# Altium schematic sheet Sheet1.SchDoc
size C
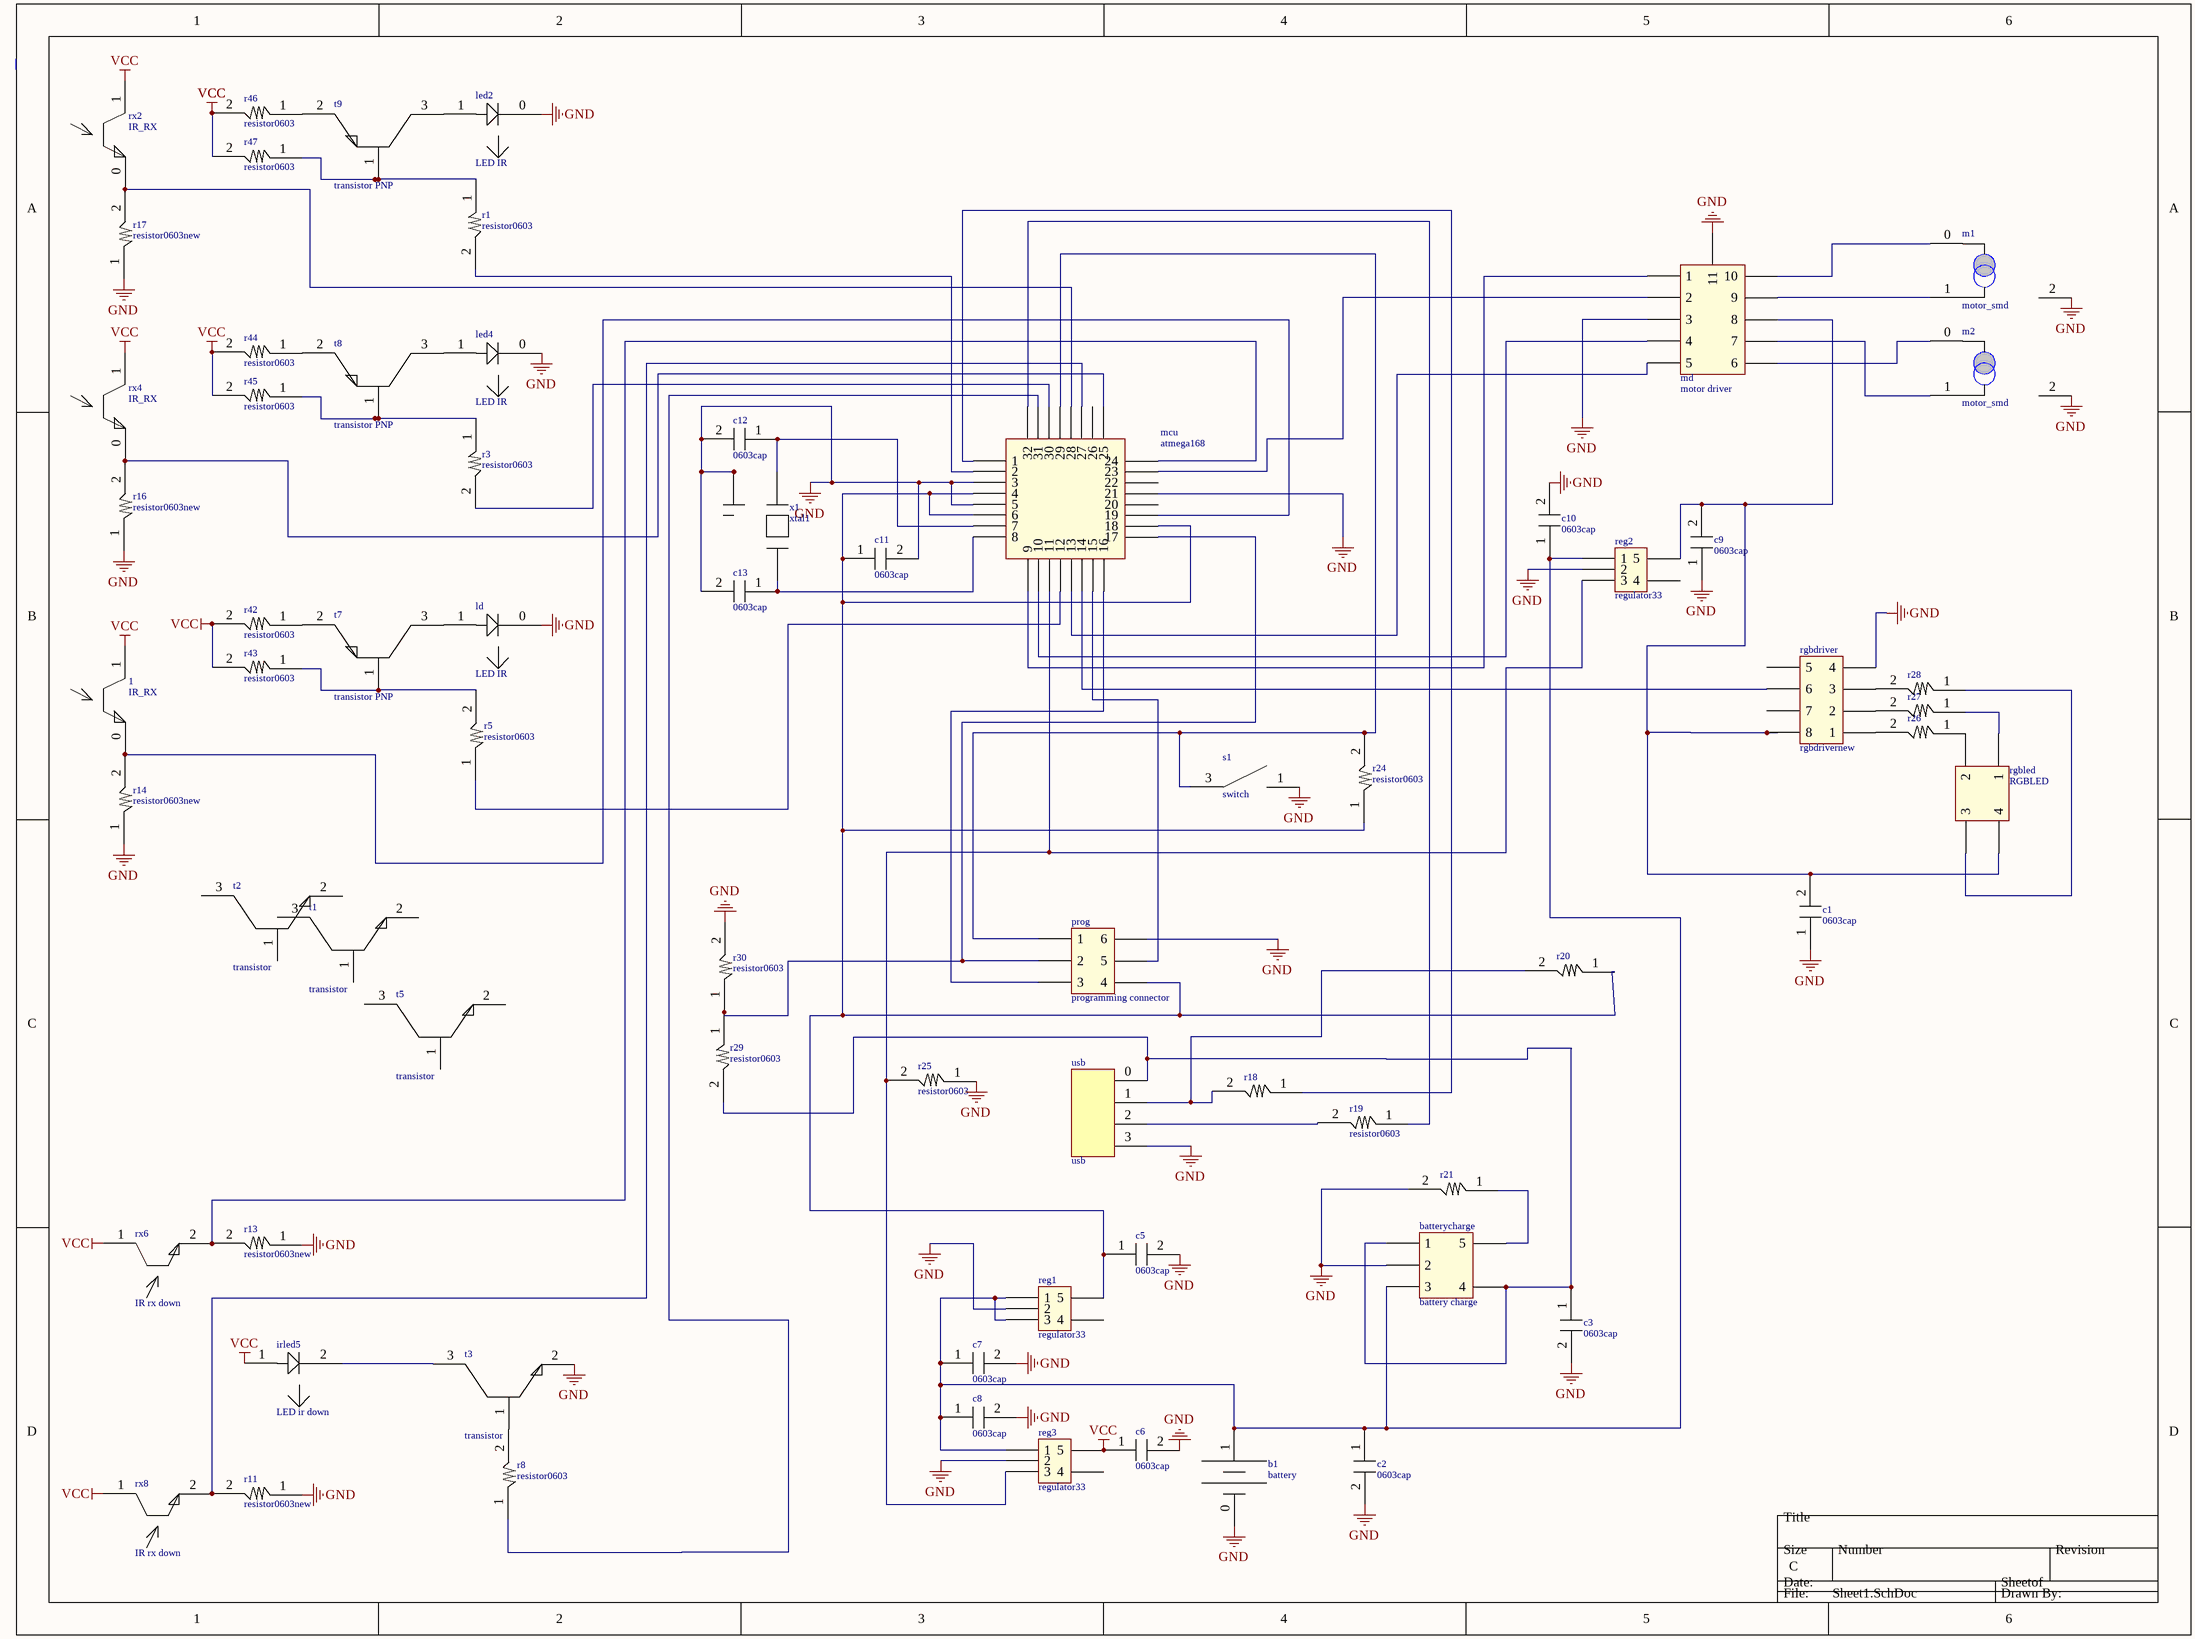
[diagram p0: Sheet1.SchDoc]

## Parts
1  IR_RX  [ir sensor]
b1  battery  [battery]
batterycharge  battery charge  [Battery charger]
c1  0603cap  [0603new]
c2  0603cap  [0603new]
c3  0603cap  [0603new]
c5  0603cap  [0603new]
c6  0603cap  [0603new]
c7  0603cap  [0603new]
c8  0603cap  [0603new]
c9  0603cap  [0603new]
c10  0603cap  [0603new]
c11  0603cap  [0603new]
c12  0603cap  [0603new]
c13  0603cap  [0603new]
irled5  LED ir down  [irdown]
ld  LED IR  [ir led]
led2  LED IR  [ir led]
led4  LED IR  [ir led]
m1  motor_smd  [motor]
m2  motor_smd  [motor]
mcu  atmega168  [32pintqfp]
md  motor driver  [motor driver]
prog  programming connector  [Program connector]
r1  resistor0603  [0603new]
r3  resistor0603  [0603new]
r5  resistor0603  [0603new]
r8  resistor0603  [0603new]
r11  resistor0603new  [0603new]
r13  resistor0603new  [0603new]
r14  resistor0603new  [0603new]
r16  resistor0603new  [0603new]
r17  resistor0603new  [0603new]
r18  resistor0603  [0603new]  (value not drawn)
r19  resistor0603  [0603new]
r20  resistor0603  [0603new]  (value not drawn)
r21  resistor0603  [0603new]  (value not drawn)
r24  resistor0603  [0603new]
r25  resistor0603  [0603new]
r26  resistor0603  [0603new]  (value not drawn)
r27  resistor0603  [0603new]  (value not drawn)
r28  resistor0603  [0603new]  (value not drawn)
r29  resistor0603  [0603new]
r30  resistor0603  [0603new]
r42  resistor0603  [0603new]
r43  resistor0603  [0603new]
r44  resistor0603  [0603new]
r45  resistor0603  [0603new]
r46  resistor0603  [0603new]
r47  resistor0603  [0603new]
reg1  regulator33  [regulator]
reg2  regulator33  [regulator]
reg3  regulator33  [regulator]
rgbdriver  rgbdrivernew  [RGBdrivernew]
rgbled  RGBLED  [rgbled]
rx2  IR_RX  [ir sensor]
rx4  IR_RX  [ir sensor]
rx6  IR rx down  [irdown]
rx8  IR rx down  [irdown]
s1  switch  [switch]
t1  transistor  [transistor]
t2  transistor  [transistor]
t3  transistor  [transistor]
t5  transistor  [transistor]
t7  transistor PNP  [transistor]
t8  transistor PNP  [transistor]
t9  transistor PNP  [transistor]
usb  usb  [usb]
x1  xtal1  [xtal1]

## Nets
GND: b1.0 batterycharge.2 c1.1 c2.2 c3.2 c5.2 c6.2 c7.2 c8.2 c9.1 c10.2 c11.2 c12.2 c13.2 ld.0 led2.0 led4.0 m1.2 m2.2 mcu.3 mcu.5 mcu.21 md.3 md.11 prog.6 r11.1 r13.1 r14.1 r16.1 r17.1 r21.2 r25.1 r30.2 reg1.2 reg2.2 reg3.2 rgbdriver.4 s1.1 t3.2 usb.3 x1.2 x1.4
VCC: 1.1 c6.1 irled5.1 r42.2 r43.2 r44.2 r45.2 r46.2 r47.2 reg3.5 rx2.1 rx4.1 rx6.1 rx8.1
Net1_0: 1.0 mcu.19 r14.2
Netb1_1: b1.1 b1.2 batterycharge.3 c2.1 c7.1 c8.1 c10.1 reg1.1 reg1.3 reg2.1 reg3.1
Netbatterycharge_1: batterycharge.1 batterycharge.4 c3.1 r29.2 usb.0
Netbatterycharge_5: batterycharge.5 r21.1
Netc1_2: c1.2 c9.2 md.8 reg2.5 rgbdriver.8 rgbled.4
Netc5_1: c5.1 c11.1 mcu.4 mcu.6 mcu.18 prog.4 r20.1 r24.1 reg1.5
Netc12_1: c12.1 mcu.7 x1.1
Netc13_1: c13.1 mcu.8 x1.3
Netirled5_2: irled5.2 t3.3
Netld_1: ld.1 t7.3
Netled2_1: led2.1 t9.3
Netled4_1: led4.1 t8.3
Netm1_0: m1.0 md.10
Netm1_1: m1.1 md.9
Netm2_0: m2.0 md.6
Netm2_1: m2.1 md.7
Netmcu_1: mcu.1 r18.1
Netmcu_2: mcu.2 r1.2
Netmcu_9: mcu.9 md.1
Netmcu_10: mcu.10 md.4
Netmcu_11: mcu.11 r25.2 reg2.3 reg3.3
Netmcu_12: mcu.12 r5.1
Netmcu_13: mcu.13 md.5
Netmcu_14: mcu.14 rgbdriver.6
Netmcu_15: mcu.15 prog.5
Netmcu_16: mcu.16 prog.3
Netmcu_17: mcu.17 prog.2 r29.1 r30.1
Netmcu_23: mcu.23 md.2
Netmcu_24: mcu.24 r13.2 rx6.2
Netmcu_25: mcu.25 r16.2 rx4.0
Netmcu_27: mcu.27 r11.2 rx8.2
Netmcu_28: mcu.28 r17.2 rx2.0
Netmcu_29: mcu.29 prog.1 r24.2 s1.3
Netmcu_30: mcu.30 r3.2
Netmcu_31: mcu.31 r8.1
Netmcu_32: mcu.32 r19.1
Netr1_1: r1.1 r47.1 t9.1
Netr3_1: r3.1 r45.1 t8.1
Netr5_2: r5.2 r43.1 t7.1
Netr8_2: r8.2 t3.1
Netr18_2: r18.2 r20.2 usb.1
Netr19_2: r19.2 usb.2
Netr26_1: r26.1 rgbled.2
Netr26_2: r26.2 rgbdriver.1
Netr27_1: r27.1 rgbled.1
Netr27_2: r27.2 rgbdriver.2
Netr28_1: r28.1 rgbled.3
Netr28_2: r28.2 rgbdriver.3
Netr42_1: r42.1 t7.2
Netr44_1: r44.1 t8.2
Netr46_1: r46.1 t9.2

Not connected (* = marked no-connect by the designer): mcu 20 22 26; reg1 4; reg2 4; reg3 4; rgbdriver 5 7; t1 1 2 3; t2 1 2 3; t5 1 2 3

## Library data of the parts
rgbdriver = rgbdrivernew: rgbdrver
x1 = xtal